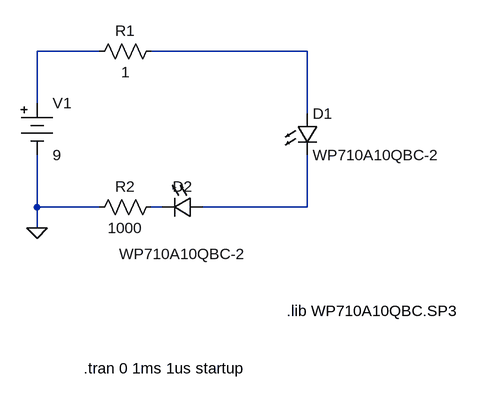
[diagram p0: schematic Draft1.asc]
Draft1.asc, the LTspice schematic file:
Version 4
SHEET 1 880 680
WIRE 288 128 192 128
WIRE 608 128 368 128
WIRE 192 208 192 128
WIRE 608 224 608 128
WIRE 192 368 192 288
WIRE 288 368 192 368
WIRE 384 368 368 368
WIRE 608 368 608 288
WIRE 608 368 448 368
WIRE 192 400 192 368
FLAG 192 400 0
SYMBOL Misc/battery 192 192 R0
SYMATTR InstName V1
SYMATTR Value 9
SYMATTR SpiceLine Rser=0
SYMBOL res 384 112 R90
WINDOW 0 0 56 VBottom 2
WINDOW 3 32 56 VTop 2
SYMATTR InstName R1
SYMATTR Value 1
SYMBOL LED 592 224 R0
SYMATTR InstName D1
SYMATTR Value WP710A10QBC-2
SYMBOL LED 448 352 R90
WINDOW 0 0 32 VBottom 2
WINDOW 3 72 32 VTop 2
SYMATTR InstName D2
SYMATTR Value WP710A10QBC-2
SYMBOL res 384 352 R90
WINDOW 0 0 56 VBottom 2
WINDOW 3 32 56 VTop 2
SYMATTR InstName R2
SYMATTR Value 1000
TEXT 576 528 Left 2 !.lib WP710A10QBC.SP3
TEXT 264 616 Left 2 !.tran 0 1ms 1us startup

The netlist it stands for:
* Draft1.asc
V1 N001 0 9 Rser=0
R1 N002 N001 1
D1 N002 N004 WP710A10QBC-2
D2 N004 N003 WP710A10QBC-2
R2 N003 0 1000
.model D D
.lib standard.dio
.lib WP710A10QBC.SP3
.tran 0 1ms 1us startup
.backanno
.end